# Altium schematic sheet MainSheet.SchDoc
size A4; SheetNumber: 1; SheetTotal: 6
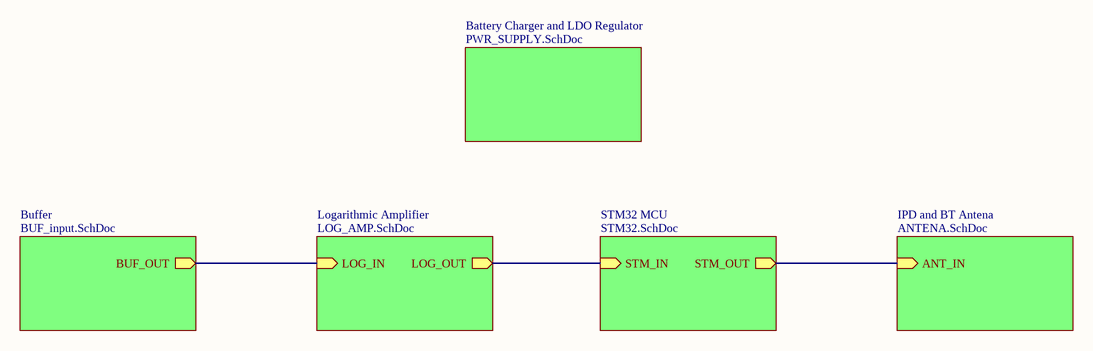
[diagram p0: MainSheet.SchDoc]

## Sub-sheets
Battery Charger and LDO Regulator = PWR_SUPPLY.SchDoc: no entries
Buffer = BUF_input.SchDoc: BUF_OUT (out)
IPD and BT Antena = ANTENA.SchDoc: ANT_IN (in)
Logarithmic Amplifier = LOG_AMP.SchDoc: LOG_OUT (out), LOG_IN (in)
STM32 MCU = STM32.SchDoc: STM_OUT (out), STM_IN (in)

## Nets
(unnamed): sheet IPD and BT Antena/ANT_IN, sheet STM32 MCU/STM_OUT
(unnamed): sheet STM32 MCU/STM_IN, sheet Logarithmic Amplifier/LOG_OUT
(unnamed): sheet Logarithmic Amplifier/LOG_IN, sheet Buffer/BUF_OUT